# EAGLE schematic circuitdraft (EAGLE 9.5.1)
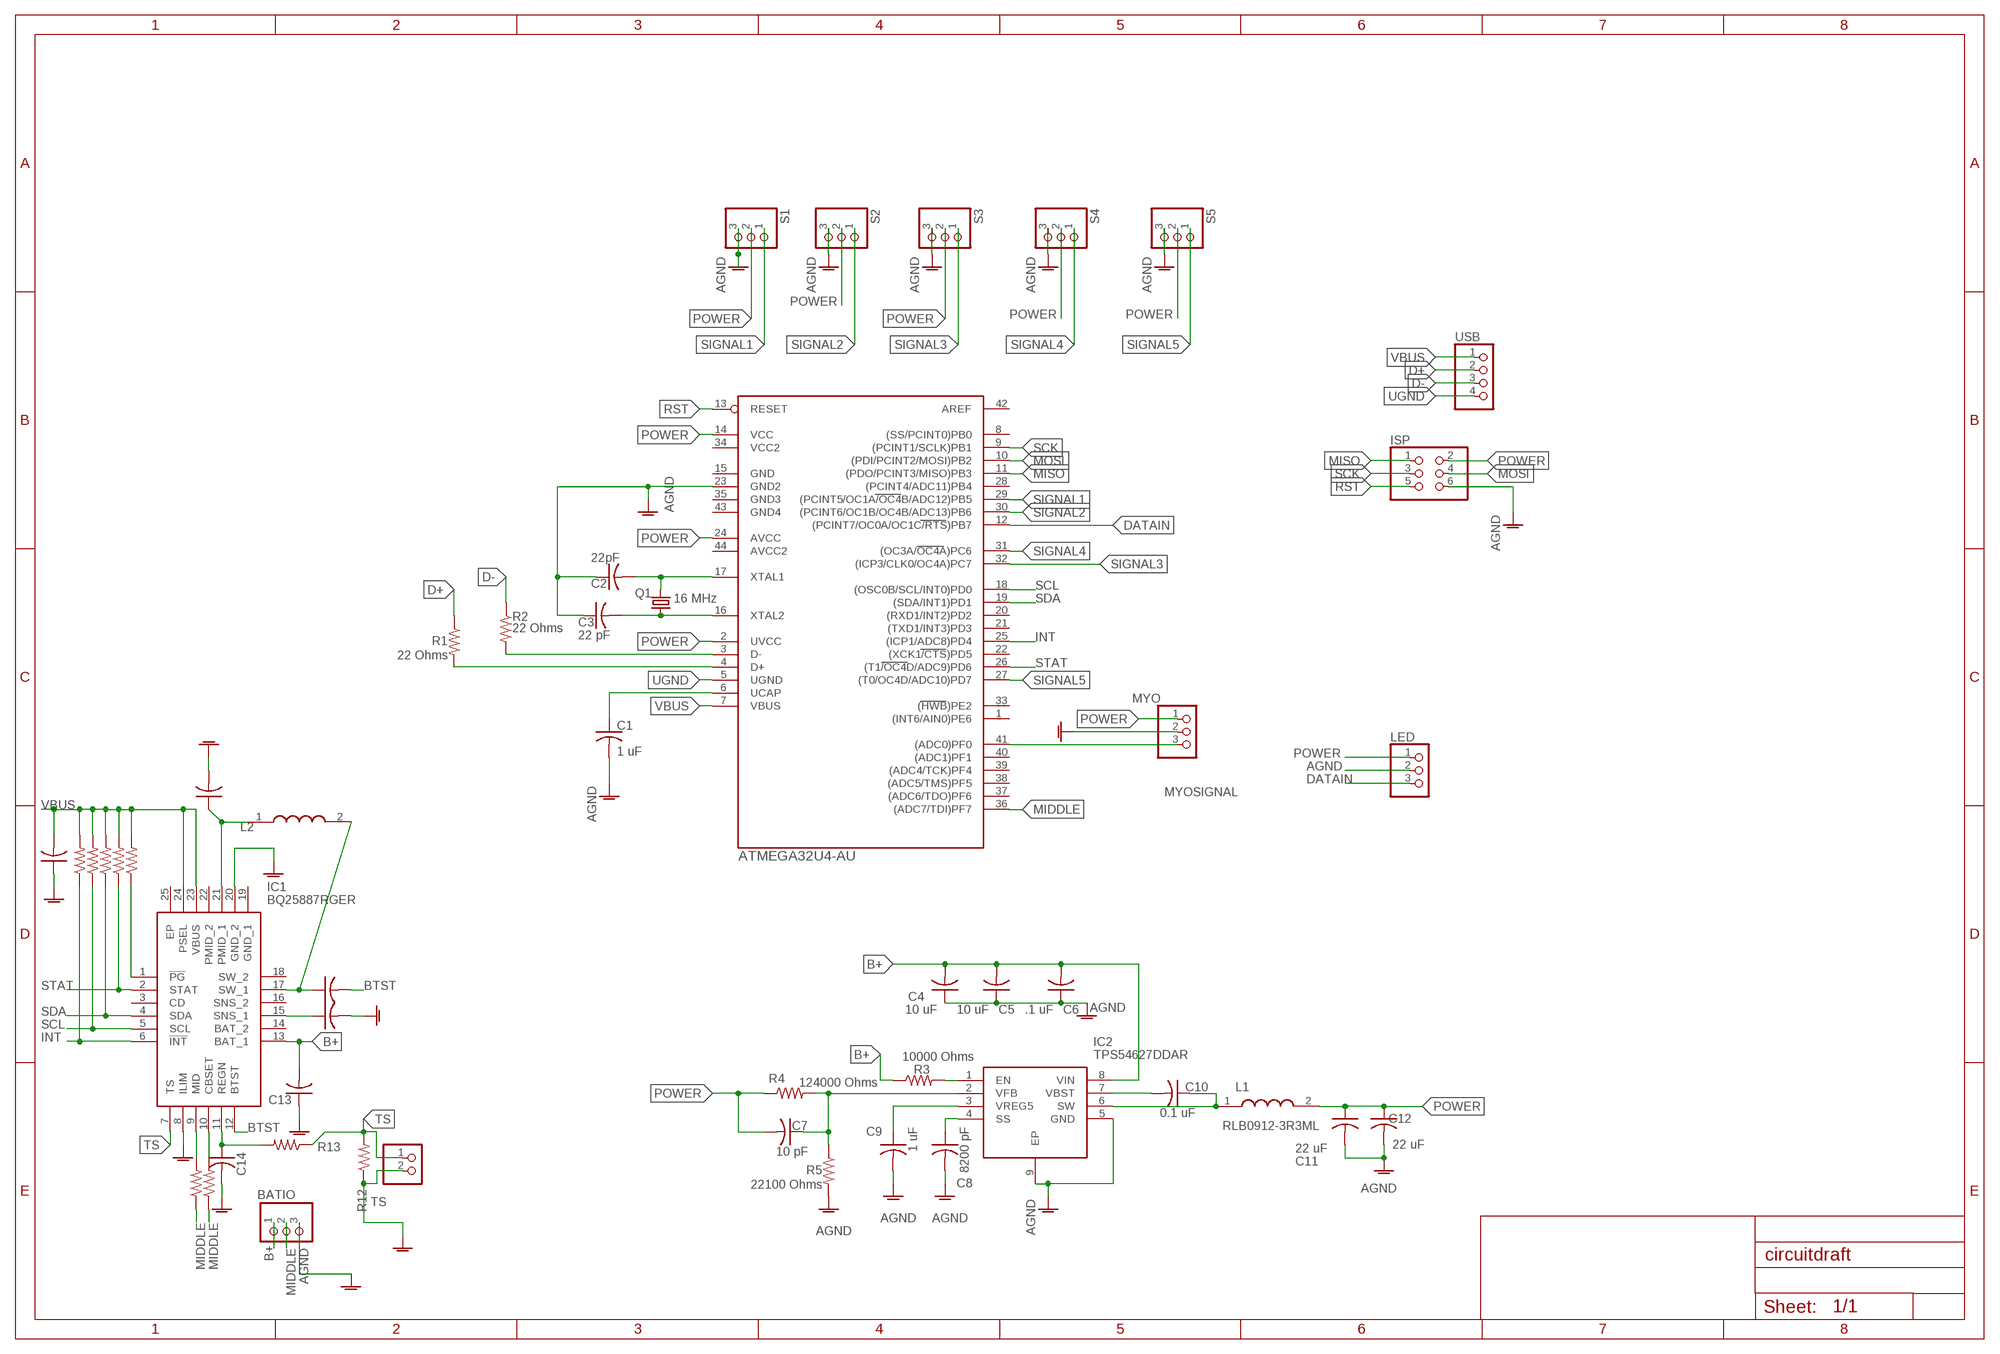
[diagram p0: schematic, sheet 1]

## Parts
BATIO  PINHD-1X3  [1X03]
C1  1 uF  C-USC0805  [C0805]
C2  22pF  C-USC0805  [C0805]
C3  22 pF  C-USC0805  [C0805]
C4  10 uF  C-USC0805  [C0805]
C5  10 uF  C-USC0805  [C0805]
C6  .1 uF  C-USC0805  [C0805]
C7  10 pF  C-USC0805  [C0805]
C8  8200 pF  C-USC0805  [C0805]
C9  1 uF  C-USC0805  [C0805]
C10  0.1 uF  C-USC0805  [C0805]
C11  22 uF  C-USC0805  [C0805]
C12  22 uF  C-USC0805  [C0805]
C13  1 uF  C-USC0805  [C0805]
C14  4.7 uF  C-USC0805  [C0805]
C15  47 nF  C-USC0805  [C0805]
C16  44 uF  C-USC0805  [C0805]
C17  1 uF  C-USC0805  [C0805]
C18  10 uF  C-USC0805  [C0805]
IC1  BQ25887RGER  [QFN50P400X400X100-25N]
IC2  TPS54627DDAR  [SOIC127P600X170-9N]
ISP  PINHD-2X3  [2X03]
L1  RLB0912-3R3ML  [RLB0914]
L2  1 uH  TFM201610GHM-1R0MTAA  [INDC2016X100N]
LED  PINHD-1X3  [1X03]
MYO  PINHD-1X3  [1X03]
Q1  16 MHz  CRYSTALHC49S  [HC49/S]
R1  22 Ohms  R-US_R0603  [R0603]
R2  22 Ohms  R-US_R0603  [R0603]
R3  10000 Ohms  R-US_R0603  [R0603]
R4  124000 Ohms  R-US_R0603  [R0603]
R5  22100 Ohms  R-US_R0603  [R0603]
R6  12 Ohms  R-US_R0603  [R0603]
R7  10000 Ohms  R-US_R0603  [R0603]
R8  10000 Ohms  R-US_R0603  [R0603]
R9  10000 Ohms  R-US_R0603  [R0603]
R10  10000 Ohms  R-US_R0603  [R0603]
R11  10000 Ohms  R-US_R0603  [R0603]
R12  30.1 kOhms  R-US_R0603  [R0603]
R13  5.23 kOhms  R-US_R0603  [R0603]
R14  300 Ohms  R-US_R0603  [R0603]
S1  PINHD-1X3  [1X03]
S2  PINHD-1X3  [1X03]
S3  PINHD-1X3  [1X03]
S4  PINHD-1X3  [1X03]
S5  PINHD-1X3  [1X03]
TS  PINHD-1X2  [1X02]
U$1  ATMEGA32U4-AU  [TQFP44]
USB  PINHD-1X4  [1X04]

## Nets
AGND: BATIO.3 C1.2 C2.1 C3.1 C4.1 C5.1 C6.1 C8.2 C9.2 C11.2 C12.2 C13.1 C14.2 C16.2 C17.1 C18.2 IC1.8(ILIM) IC1.20(GND_2) IC2.5(GND) IC2.9(EP) ISP.6 LED.2 MYO.2 R5.2 R12.1 S1.3 S2.3 S3.3 S4.3 S5.3 TS.2 U$1.23(GND2)
B+: BATIO.1 C4.2 C5.2 C6.2 C13.2 IC1.13(BAT_1) IC2.8(VIN) R3.1
BTST: C15.2 IC1.12(BTST)
D+: R1.1 USB.2
D-: R2.1 USB.3
DATAIN: LED.3 U$1.12((PCINT7/OC0A/OC1C/RTS)PB7)
INT: IC1.6(!INT) R10.1 U$1.25((ICP1/ADC8)PD4)
MIDDLE: BATIO.2 R6.1 R14.1 U$1.36((ADC7/TDI)PF7)
MISO: ISP.1 U$1.11((PDO/PCINT3/MISO)PB3)
MOSI: ISP.4 U$1.10((PDI/PCINT2/MOSI)PB2)
MYOSIGNAL: MYO.3 U$1.41((ADC0)PF0)
N$1: IC2.1(EN) R3.2
N$2: R2.2 U$1.3(D-)
N$3: IC1.10(CBSET) R6.2
N$4: R1.2 U$1.4(D+)
N$5: C3.2 Q1.1 U$1.16(XTAL2)
N$6: C2.2 Q1.2 U$1.17(XTAL1)
N$7: IC1.1(!PG) R9.1
N$8: C1.1 U$1.6(UCAP)
N$9: C8.1 IC2.4(SS)
N$10: IC1.9(MID) R14.2
N$11: C7.1 IC2.2(VFB) R4.2 R5.1
N$13: C9.1 IC2.3(VREG5)
N$14: C10.1 IC2.6(SW) L1.1
N$15: C10.2 IC2.7(VBST)
N$18: C15.1 IC1.17(SW_1) L2.2
N$19: C14.1 IC1.11(REGN) R13.2
N$20: C16.1 IC1.15(SNS_1)
N$21: C18.1 IC1.21(PMID_1) L2.1
POWER: C7.2 C11.1 C12.1 ISP.2 L1.2 LED.1 MYO.1 R4.1 S1.2 S2.2 S3.2 S4.2 S5.2 U$1.2(UVCC) U$1.14(VCC) U$1.24(AVCC)
RST: ISP.5 U$1.13(RESET)
SCK: ISP.3 U$1.9((PCINT1/SCLK)PB1)
SCL: IC1.5(SCL) R8.1 U$1.18((OSC0B/SCL/INT0)PD0)
SDA: IC1.4(SDA) R7.1 U$1.19((SDA/INT1)PD1)
SIGNAL1: S1.1 U$1.29((PCINT5/OC1A/OC4B/ADC12)PB5)
SIGNAL2: S2.1 U$1.30((PCINT6/OC1B/OC4B/ADC13)PB6)
SIGNAL3: S3.1 U$1.32((ICP3/CLK0/OC4A)PC7)
SIGNAL4: S4.1 U$1.31((OC3A/OC4A)PC6)
SIGNAL5: S5.1 U$1.27((T0/OC4D/ADC10)PD7)
STAT: IC1.2(STAT) R11.1 U$1.26((T1/OC4D/ADC9)PD6)
TS: IC1.7(TS) R12.2 R13.1 TS.1
UGND: U$1.5(UGND) USB.4
VBUS: C17.2 IC1.23(VBUS) IC1.24(PSEL) R7.2 R8.2 R9.2 R10.2 R11.2 U$1.7(VBUS) USB.1
Unconnected: IC1.3(CD) IC1.14(BAT_2) IC1.16(SNS_2) IC1.18(SW_2) IC1.19(GND_1) IC1.22(PMID_2) IC1.25(EP) U$1.1((INT6/AIN0)PE6) U$1.8((SS/PCINT0)PB0) U$1.15(GND) U$1.20((RXD1/INT2)PD2) U$1.21((TXD1/INT3)PD3) U$1.22((XCK1/CTS)PD5) U$1.28((PCINT4/ADC11)PB4) U$1.33((HWB)PE2) U$1.34(VCC2) U$1.35(GND3) U$1.37((ADC6/TDO)PF6) U$1.38((ADC5/TMS)PF5) U$1.39((ADC4/TCK)PF4) U$1.40((ADC1)PF1) U$1.42(AREF) U$1.43(GND4) U$1.44(AVCC2)

## Library data of the parts
BATIO LED MYO S1-S5 = pinhead:PINHD-1X3: PIN HEADER
C1-C18 = rcl:C-US: CAPACITOR, American symbol; SPICEPREFIX: C
IC1 = SamacSys_Parts:BQ25887RGER: I2C Controlled, 2-cell, 2-A boost-mode battery charger with cell balancing Source: Datasheet <http://www.ti.com/lit/gpn/BQ25887>; DESCRIPTION: I2C Controlled, 2-cell, 2-A boost-mode battery charger with cell balancing; HEIGHT: 1mm; MANUFACTURER_NAME: Texas Instruments; MANUFACTURER_PART_NUMBER: BQ25887RGER; MOUSER_PART_NUMBER: 595-BQ25887RGER; MOUSER_PRICE-STOCK: https://www.mouser.com/Search/Refine.aspx?Keyword=595-BQ25887RGER
IC2 = TPS54627DDAR:TPS54627DDAR: 4.5V to 18V Input, 6-A Synchronous Step-Down Converter Source: Datasheet <http://www.ti.com/lit/gpn/tps54627>; DESCRIPTION: 4.5V to 18V Input, 6-A Synchronous Step-Down Converter; HEIGHT: 1.7mm; MANUFACTURER_NAME: Texas Instruments; MANUFACTURER_PART_NUMBER: TPS54627DDAR; MOUSER_PART_NUMBER: 595-TPS54627DDAR; MOUSER_PRICE-STOCK: https://www.mouser.com/Search/Refine.aspx?Keyword=595-TPS54627DDAR
ISP = pinhead:PINHD-2X3: PIN HEADER
L1 = SamacSys_Parts:RLB0912-3R3ML: Radial Fixed Through Hole Inductor 3.3uH Bourns 3.3 uH +/-20% Ferrite Radial Inductor, Max SRF:50MHz, Q:30, 3.6A Idc, 0.018 Rdc RLB Source: Datasheet <https://componentsearchengine.com/Datasheets/1/RLB0912-3R3ML.pdf>; DESCRIPTION: Radial Fixed Through Hole Inductor 3.3uH Bourns 3.3 uH +/-20% Ferrite Radial Inductor, Max SRF:50MHz, Q:30, 3.6A Idc, 0.018 Rdc RLB; HEIGHT: mm; MANUFACTURER_NAME: Bourns; MANUFACTURER_PART_NUMBER: RLB0912-3R3ML; MOUSER_PART_NUMBER: 652-RLB0912-3R3ML; MOUSER_PRICE-STOCK: https://www.mouser.com/Search/Refine.aspx?Keyword=652-RLB0912-3R3ML
L2 = SamacSys_Parts:TFM201610GHM-1R0MTAA: Fixed Inductors 1.0uH 50mOhms 3.6A 20% Source: Datasheet <https://componentsearchengine.com/Datasheets/1/TFM201610GHM-1R0MTAA.pdf>; DESCRIPTION: Fixed Inductors 1.0uH 50mOhms 3.6A 20%; HEIGHT: 1mm; MANUFACTURER_NAME: TDK; MANUFACTURER_PART_NUMBER: TFM201610GHM-1R0MTAA; MOUSER_PART_NUMBER: 810-TFM201610GHM1R0A; MOUSER_PRICE-STOCK: https://www.mouser.com/Search/Refine.aspx?Keyword=810-TFM201610GHM1R0A
Q1 = crystal:CRYSTAL: CRYSTAL; OC_FARNELL: 1667008; OC_NEWARK: unknown
R1-R14 = rcl:R-US_: RESISTOR, American symbol; SPICEPREFIX: R
TS = pinhead:PINHD-1X2: PIN HEADER
U$1 = mega32U4:ATMEGA32U4-AU
USB = pinhead:PINHD-1X4: PIN HEADER